# Altium schematic sheet CAN.SchDoc
size A4; SheetNumber: 2; SheetTotal: 3
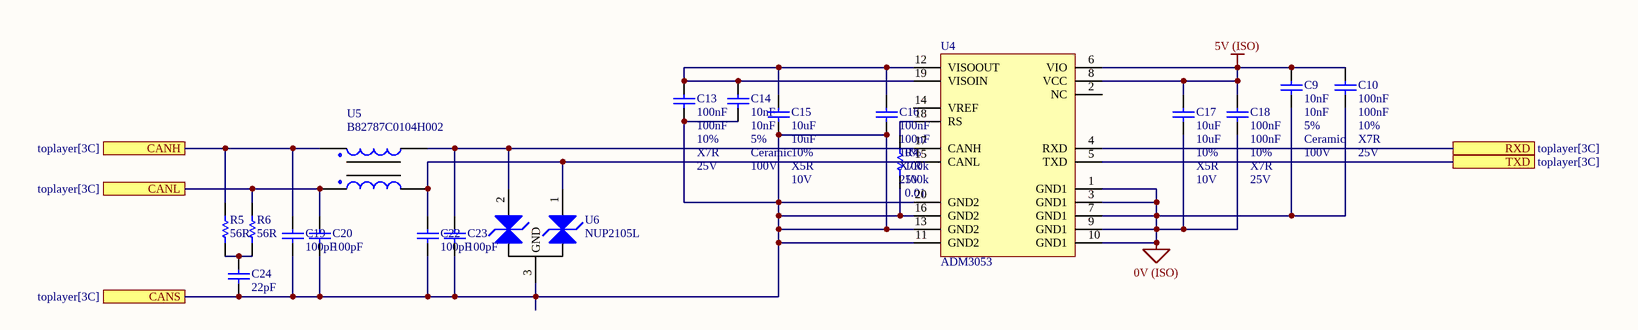
[diagram p0: CAN.SchDoc]

## Parts
C9  10nF  Tolerance: 5%  Material: Ceramic  Rated Voltage: 100V  [1206]
C10  100nF  Tolerance: 10%  Material: X7R  Rated Voltage: 25V  [0805]
C13  100nF  Tolerance: 10%  Material: X7R  Rated Voltage: 25V  [0805]
C14  10nF  Tolerance: 5%  Material: Ceramic  Rated Voltage: 100V  [1206]
C15  10uF  Tolerance: 10%  Material: X5R  Rated Voltage: 10V  [0805]
C16  100nF  Tolerance: 10%  Material: X7R  Rated Voltage: 25V  [0805]
C17  10uF  Tolerance: 10%  Material: X5R  Rated Voltage: 10V  [0805]
C18  100nF  Tolerance: 10%  Material: X7R  Rated Voltage: 25V  [0805]
C19  100pF  [0805]
C20  100pF  [0805]
C22  100pF  [0805]
C23  100pF  [0805]
C24  22pF  [0805]
R4  100k  Tolerance: 0.01  [0805]
R5  56R  [0805]
R6  56R  [0805]
U4  ADM3053  [AD SOIC-W 20]
U5  B82787C0104H002  [TDK 4-PC Pad]
U6  NUP2105L  [ON SOT-23]

## Ports
CANH (see toplayer[3C]), CANL (see toplayer[3C]), CANS (see toplayer[3C]), RXD (see toplayer[3C]), TXD (see toplayer[3C])

## Nets
0V (ISO): C9.1 C10.1 C17.1 C18.1 U4.1(GND1) U4.3(GND1) U4.7(GND1) U4.9(GND1) U4.10(GND1)
5V (ISO): C9.2 C10.2 C17.2 C18.2 U4.6(VIO) U4.8(VCC)
CANH: C19.2 R5.2 U5.1 ; port CANH
CANL: C20.2 R6.2 U5.4 ; port CANL
CANS: C13.1 C14.1 C15.1 C16.1 C19.1 C20.1 C22.1 C23.1 C24.1 R4.1 U4.11(GND2) U4.13(GND2) U4.16(GND2) U4.20(GND2) U6.3(GND) ; port CANS
RXD: U4.4(RXD) ; port RXD
TXD: U4.5(TXD) ; port TXD
NetC13_2: C13.2 C14.2 C15.2 C16.2 U4.12(VISOOUT) U4.19(VISOIN)
NetC22_2: C22.2 U4.15(CANL) U5.3 U6.1(CAN_H)
NetC23_2: C23.2 U4.17(CANH) U5.2 U6.2(CAN_L)
NetC24_2: C24.2 R5.1 R6.1
NetR4_2: R4.2 U4.18(RS)

Not connected (* = marked no-connect by the designer): U4 2(NC) 14(VREF)

## Library data of the parts
C9 C14 = GCM3195C2A103JA16D: Manufacturer: muRata; Value: 10nF; Part Number: GCM3195C2A103JA16D; Digikey Part Number: 490-4978-2-ND
C10 C13 C16 C18 = GCM21BR71E104KA37L: Manufacturer: muRata; Value: 100nF; Part Number: GCM21BR71E104KA37L
C15 C17 = GCM21BR61A106KA37L: Manufacturer: muRata; Value: 10uF; Part Number: GCM21BR61A106KA37L
C19 C20 C22 C23 = GCM21B5C1H101JA37L: Manufacturer: muRata; Tolerance: 5%; Material: C0G; Rated Voltage: 50V; Part Number: GCM21B5C1H101JA37L; Value: 100pF
C24 = GCM21B5C1H220JA37L: Manufacturer: muRata; Tolerance: 5%; Material: C0G; Rated Voltage: 50V; Part Number: GCM21B5C1H220JA37L; Value: 22pF
R4 = RC0805FR07100KL: Manufacturer: YAGEO; Rated Voltage: 0.125W; Value: 100k; Part Number: RC0805FR07100KL; Material: FR-07; qty: 50
R5 R6 = RC0805FR0756RL: Manufacturer: YAGEO; Tolerance: 0.01; Rated Voltage: 0.125W; Part Number: RC0805FR0756RL; Value: 56R; Material: FR-07; qty: 50
U4 = ADM3053: Isolated CAN Transceiver; Manufacturer: Analogue Devices; Part Number: ADM3053; Digikey Part Number: ADM3053BRWZ-ND; Digikey Link: https://www.digikey.com/product-detail/en/analog-devices-inc/ADM3053BRWZ/ADM3053BRWZ-ND/2709332
U5 = B82787C0104H002: Common mode choke intended for CANBUS 150mA 50V); Manufacturer: EPCOS (TDK); Part Number: B82787C0104H002; Digikey Part Number: 495-4598-2-ND; Digikey Link: https://www.digikey.com/product-detail/en/epcos-tdk/B82787C0104H002/495-4598-2-ND/3680998
U6 = NUP2105L: Dual Line CAN Bus Protector; Manufacturer: ON Semiconductor; Part Number: NUP2105L; Type: CAN ESD Protection; Digikey Part Number: NUP2105LT1GOSCT-ND; Digikey Link: https://www.digikey.com/product-detail/en/on-semiconductor/NUP2105LT1G/NUP2105LT1GOSCT-ND/1485001